# EAGLE board xenon-v1.00 (EAGLE 9.0.1), part 1 of 2
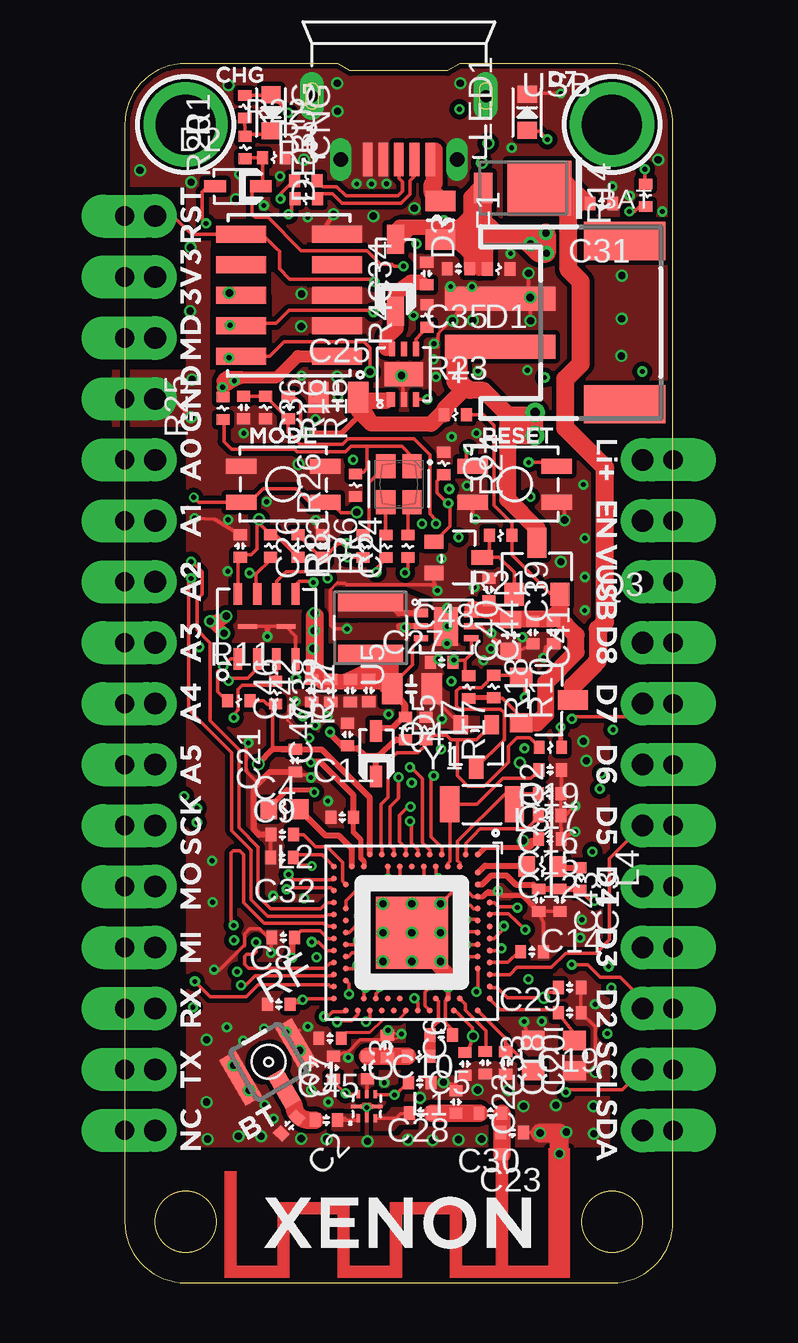
[diagram p1: board, top side]
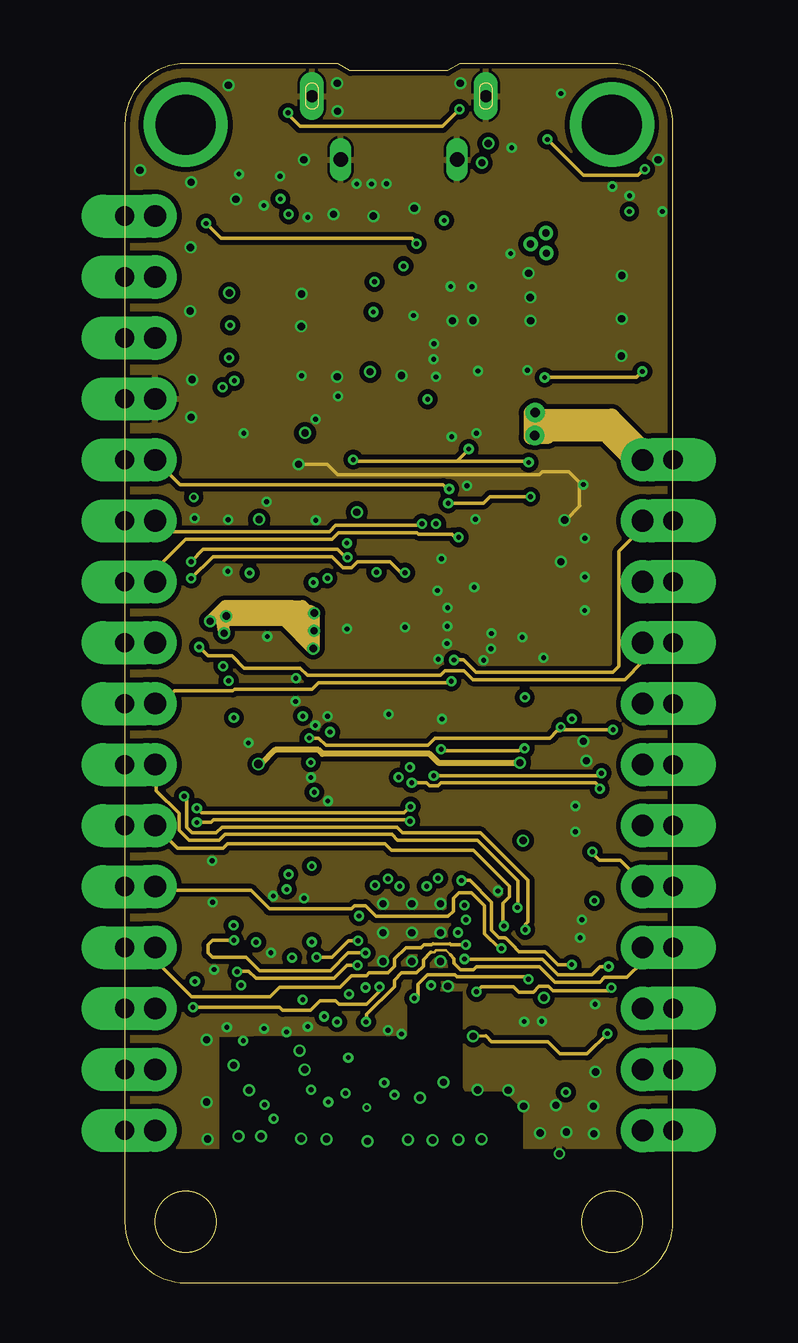
[diagram p2: board, inner layer Route2]
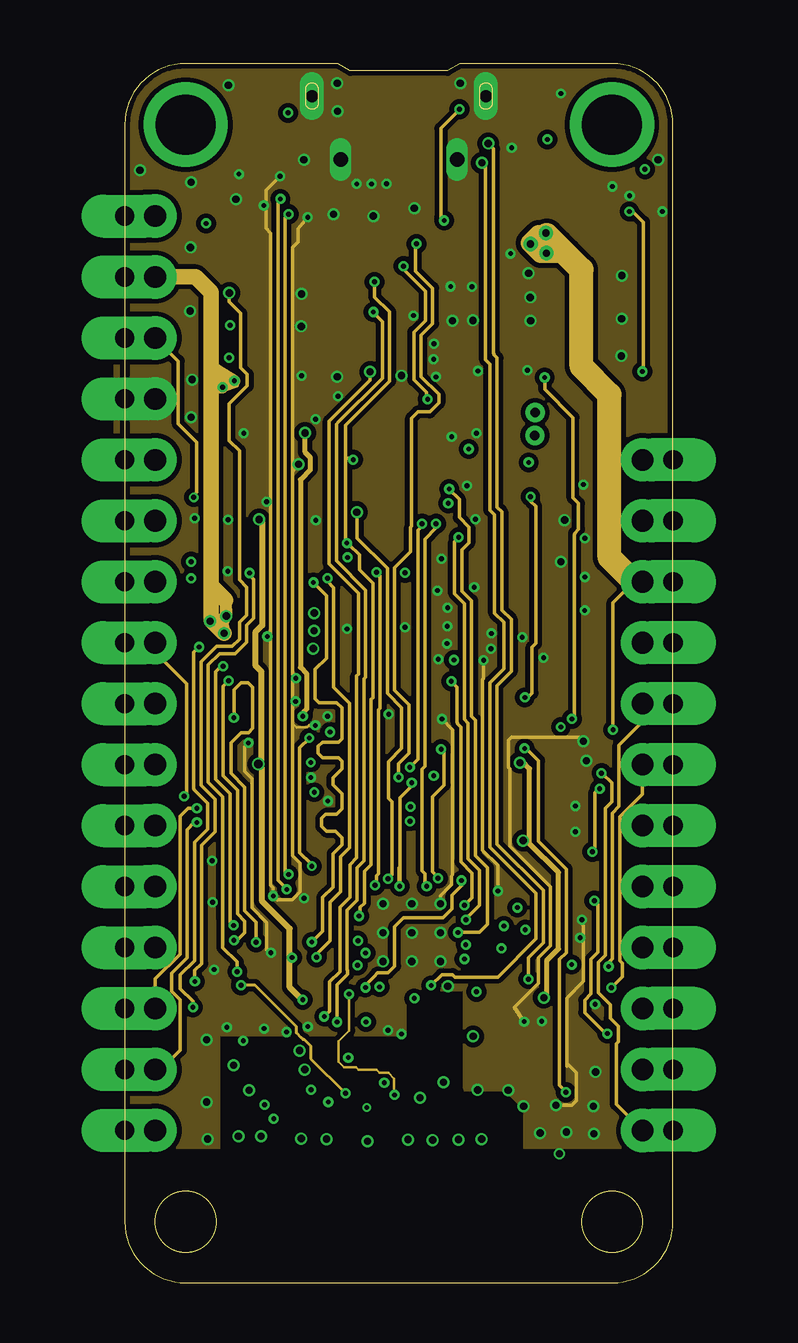
[diagram p3: board, inner layer Route15]
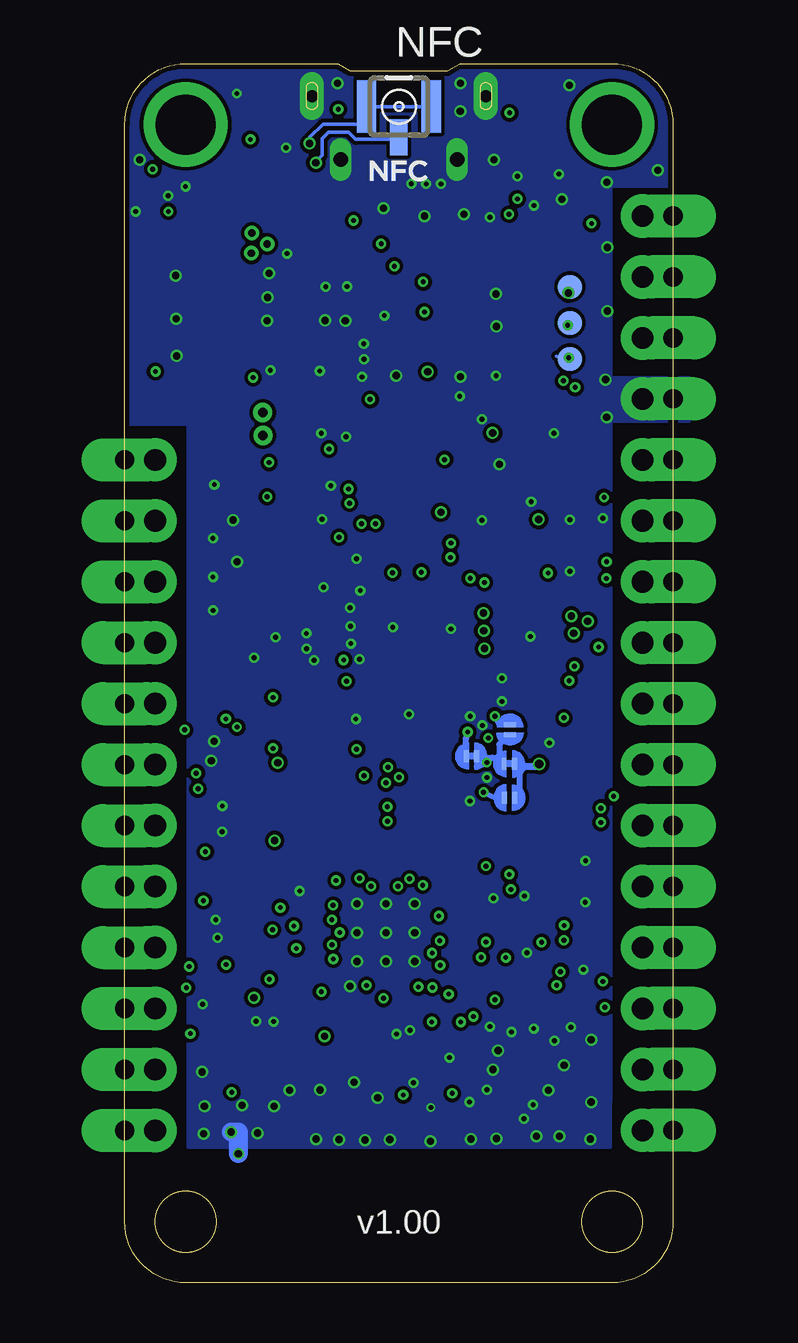
[diagram p4: board, bottom side, seen from below]

Size 22.86 x 50.8 mm. Coordinates in mm from the lower left corner, seen from the top.
Outline: 0,48.26 0,2.54 arc90 2.54,0 20.32,0 arc90 22.86,2.54 22.86,48.26 arc90 20.32,50.8 13.97,50.8 13.46,50.5 9.4,50.5 8.89,50.8 2.54,50.8 arc90 0,48.26
Outline: circle at 20.32,2.54 radius 1.27
Outline: circle at 2.54,2.54 radius 1.27
Copper layers (1+2*15+16): Top 0.035mm / dielectric 0.2mm / Route2 0.035mm / dielectric 0.7mm / Route15 0.035mm / dielectric 0.2mm / Bottom 0.035mm
Design rules "default *": minimum track width 4mil, minimum drill 0.2mm, track to track 6mil, track to pad 6mil, pad to pad 6mil, via to via 6mil, smd to smd 6mil, copper to edge 8mil, drill to drill 12mil, minimum pad ring 3mil, minimum via ring 3mil, stop-mask expansion 0.005mm, vias tented up to drill 16mil, thermal gap 4mil

## Footprints (pad centres in the part's own frame; a part is rotated, then mirrored left to right if it is on the bottom)
ANTENNA_F2_PCB = drill 0.305: GND 1.55,0.07 | smd 0.5 x 0.5: RF 3.95,0.09
CON_2.0MM_SMT = smd 1 x 4.6: 1 -1,-2.933; 2 1,-2.933 | smd 1.6 x 3.4: NC1 -3.4,2.267; NC2 3.4,2.267
TS-1185A-020 = smd 1.27 x 0.635: 1 -1.75,0.752; 2 1.75,0.752; 3 -1.75,-0.752; 4 1.75,-0.752
C-0402 = smd 0.45 x 0.55: 1 -0.47,0; 2 0.47,0
C0805 = smd 0.85 x 1.3: 1 -0.8,0; 2 0.85,0
C0603 = smd 0.7 x 0.85: 1 -0.65,0; 2 0.65,0
LED0603 = smd 0.7 x 0.8: 1 -0.75,0; 2 0.75,0
R-0402S = smd 0.45 x 0.55: 1 -0.47,0; 2 0.47,0
SOD-323 = smd 0.9 x 0.5: 1 -0.95,0; 2 0.95,0
SOD-123 = smd 1.2 x 0.7: 1 -1.5,0; 2 1.5,0
DIODE-DO-220AA(SMP) = smd 0.762 x 1.27: ANODE 2.349,0 | smd 2.667 x 2.3: CATHODE 0,0
CON5X2_1.27 = smd 0.7 x 2.1: 1 -2.54,-2; 2 -2.54,2; 3 -1.27,-2; 4 -1.27,2; 5 0,-2; 6 0,2; 7 1.27,-2; 8 1.27,2; 9 2.54,-2; 10 2.54,2
F0805 = smd 0.85 x 1.25: P$1 -0.8,0; P$2 0.8,0
HEADER_16P2.54 = drill 0.9 pad 1.8: 1 0,-19.05; 2 0,-16.51; 3 0,-13.97; 4 0,-11.43; 5 0,-8.89; 6 0,-6.35; 7 0,-3.81; 8 0,-1.27; 9 0,1.27; 10 0,3.81; 11 0,6.35; 12 0,8.89; 13 0,11.43; 14 0,13.97; 15 0,16.51; 16 0,19.05 | drill 0.8 pad 1.8 long: P$1 -1.27,-19.05; P$2 -1.27,-16.51; P$3 -1.27,-13.97; P$4 -1.27,-11.43; P$5 -1.27,-8.89; P$6 -1.27,-6.35; P$7 -1.27,-3.81; P$8 -1.27,-1.27; P$9 -1.27,1.27; P$10 -1.27,3.81; P$11 -1.27,6.35; P$12 -1.27,8.89; P$13 -1.27,11.43; P$14 -1.27,13.97; P$15 -1.27,16.51; P$16 -1.27,19.05
SIP-12 = drill 0.9 pad 1.8: 1 0,13.97; 2 0,11.43; 3 0,8.89; 4 0,6.35; 5 0,3.81; 6 0,1.27; 7 0,-1.27; 8 0,-3.81; 9 0,-6.35; 10 0,-8.89; 11 0,-11.43; 12 0,-13.97 | drill 0.8 pad 1.8 long: P$1 -1.27,13.97; P$2 -1.27,11.43; P$3 -1.27,8.89; P$4 -1.27,6.35; P$5 -1.27,3.81; P$6 -1.27,1.27; P$7 -1.27,-1.27; P$8 -1.27,-3.81; P$9 -1.27,-6.35; P$10 -1.27,-8.89; P$11 -1.27,-11.43; P$12 -1.27,-13.97
R-0603A = smd 0.7 x 0.85: 1 -0.65,0; 2 0.65,0
INDUCTOR-NR3015 = smd 0.8 x 2.7: 1 -1.1,0; 2 1.1,0
IPEX-20279-001E = smd 0.73 x 1.5: 1 0,1.28 | smd 0.8 x 2.2: 2@1 -1.35,0; 2@2 1.35,0
SOT323 = smd 0.6 x 0.8: 1 -0.65,-1; 2 0.65,-1 | smd 0.6 x 0.9: 3 0,1
SOT-23 = smd 0.8 x 0.95: 1 -0.95,-1; 2 0.95,-1 | smd 0.8 x 1.25: 3 0,1.15
SOT323' = smd 0.6 x 0.8: 1 -0.65,-0.95; 2 0.65,-0.95 | smd 0.6 x 0.9: 3 0,0.85
PLCC4-2MM-RGB = smd 1 x 0.8: BLUE -0.75,-0.55; CA 0.75,-0.55; GREEN -0.75,0.55; RED 0.75,0.55
TP_SHORT = smd 0.2 x 0.5: 1 -0.21,0; 2 0.21,0
TP_OPEN = smd 0.2 x 0.5: 1 -0.21,0; 2 0.21,0
TP = smd 1 x 1: P$1 0,0
TP-2.5 = drill 2.5 pad 3.2: 1 0,0
AQN507X7X0.85_HA-74_V2 = smd 3 x 3: P$74 0,0 | drill 0.3 pad 0.5: P$75 -1.2,1.2; P$76 0,1.2; P$77 1.2,1.2; P$78 -1.2,0; P$79 0,0; P$80 1.2,0; P$81 -1.2,-1.2; P$82 0,-1.2; P$85 1.2,-1.2 | smd 0.25 x 0.25: P$A8 -1.25,3.25; P$A10 -0.75,3.25; P$A12 -0.25,3.25; P$A14 0.25,3.25; P$A16 0.75,3.25; P$A18 1.25,3.25; P$A20 1.75,3.25; P$A22 2.25,3.25; P$A23 2.75,3.25; P$AA24 3.25,-2.25; P$AB2 -2.75,-2.5; P$AC5 -2,-2.75; P$AC9 -1,-2.75; P$AC11 -0.5,-2.75; P$AC13 0,-2.75; P$AC15 0.5,-2.75; P$AC17 1,-2.75; P$AC19 1.5,-2.75; P$AC21 2,-2.75; P$AC24 3.25,-2.75; P$AD2 -2.75,-3.25; P$AD4 -2.25,-3.25; P$AD6 -1.75,-3.25; P$AD8 -1.25,-3.25; P$AD10 -0.75,-3.25; P$AD12 -0.25,-3.25; P$AD14 0.25,-3.25; P$AD16 0.75,-3.25; P$AD18 1.25,-3.25; P$AD20 1.75,-3.25; P$AD22 2.25,-3.25; P$AD23 2.75,-3.25; P$B1 -3.25,2.75; P$B3 -2.5,2.75; P$B5 -2,2.75; P$B7 -1.5,2.75; P$B9 -1,2.75; P$B11 -0.5,2.75; P$B13 0,2.75; P$B15 0.5,2.75; P$B17 1,2.75; P$B19 1.5,2.75; P$B24 3.25,2.75; P$C1 -3.25,2.25; P$D2 -2.75,2; P$D23 2.75,2; P$E24 3.25,1.75; P$F2 -2.75,1.5; P$F23 2.75,1.5; P$G1 -3.25,1.25; P$H2 -2.75,1; P$H23 2.75,1; P$J1 -3.25,0.75; P$J24 3.25,0.75; P$K2 -2.75,0.5; P$L1 -3.25,0.25; P$L24 3.25,0.25; P$M2 -2.75,0; P$N1 -3.25,-0.25; P$N24 3.25,-0.25; P$P2 -2.75,-0.5; P$P23 2.75,-0.5; P$R1 -3.25,-0.75; P$R24 3.25,-0.75; P$T2 -2.75,-1; P$T23 2.75,-1; P$U1 -3.25,-1.25; P$U24 3.25,-1.25; P$V23 2.75,-1.5; P$W1 -3.25,-1.75; P$W24 3.25,-1.75; P$Y2 -2.75,-2; P$Y23 2.75,-2
USP-6C = smd 0.6 x 0.35: P$1 -1.05,0.55 | smd 0.6 x 0.25: P$2 -1.05,0; P$3 -1.05,-0.5; P$4 1.05,-0.5; P$5 1.05,0; P$6 1.05,0.5 | smd 1 x 1.6: P$7 0,0
USON8-3X4 = smd 0.9 x 0.35: 1 -1.35,1.2; 2 -1.35,0.4; 3 -1.35,-0.4; 4 -1.35,-1.2; 5 1.35,-1.2; 6 1.35,-0.4; 7 1.35,0.4; 8 1.35,1.2 | smd 0.2 x 0.8: 9 0,0.8; 10 0,-0.8
MLPD-6-1X1 = smd 0.33 x 0.15: P$1 -0.5,0.35; P$3 -0.5,-0.35; P$4 0.5,-0.35; P$5 0.5,0; P$6 0.5,0.35 | smd 0.45 x 0.15: P$2 -0.44,0 | smd 0.15 x 0.45: P$7 0,-0.43; P$8 0,0.43
MICRO_USB = smd 0.4 x 1.4: 1 1.3,0.1; 2 0.65,0.1; 3 0,0.1; 4 -0.65,0.1; 5 -1.3,0.1 | drill 0.6 pad 0.75 long: 6 2.425,0.1 | drill 0.5 pad 1 long: 7 3.625,2.75; 8 -3.625,2.75 | drill 0.6 pad 0.65 long: 9 -2.425,0.1
CRY_3215 = smd 0.8 x 1.5: 1 -1.35,0; 2 1.35,0
CRY_2520 = smd 0.95 x 0.8: 1 -0.86,-0.63; 2 0.86,-0.63; 3 0.86,0.63; 4 -0.86,0.64

## Placement (x,y rotation side)
ANT  ANT_F  [ANTENNA_F2_PCB]  19.67,5.45 180 top
BAT  CON2P_SMT  [CON_2.0MM_SMT]  18.58,40 270 top
BUTTON  TS-1185A-020  [TS-1185A-020]  6.6,33.27 180 top
C1  10pF  [C-0402]  8.41,6.78 0 top
C2  NC  [C-0402]  6.86,6.55 225 top
C3  33PF  [C-0402]  8.71,8.96 270 top
C4  4.7uF  [C-0402]  6.57,18.68 0 top
C5  1pF  [C-0402]  13.2,10.33 180 top
C6  1pF  [C-0402]  10.95,9.85 270 top
C7  10pF  [C-0402]  10.12,8.97 90 top
C8  O.1uF  [C-0402]  6.42,11.6 0 top
C9  4.7uF  [C-0402]  6.56,17.72 0 top
C10  10pF  [C-0402]  12.34,7.07 0 top
C11  4.7uF  [C-0402]  9.07,19.4 0 top
C12  1uF  [C-0402]  17.73,18.49 180 top
C13  1uF  [C-0402]  18.14,15.94 270 top
C14  1uF  [C-0402]  18.56,12.31 0 top
C15  O.1uF  [C-0402]  17.72,19.47 180 top
C16  12pF  [C-0402]  17.72,20.38 180 top
C17  12pF  [C-0402]  17.74,21.37 180 top
C18  100pF  [C-0402]  15.03,9.17 270 top
C19  12pF  [C-0402]  18.56,11.25 180 top
C20  12pF  [C-0402]  15.88,9.15 270 top
C21  4.7uF  [C-0402]  7.12,21.76 90 top
C22  0.5pF  [C-0402]  13.81,7.53 270 top
C23  0.5pF  [C-0402]  16.16,6.26 180 top
C24  0.1uF  [C-0402]  8.26,30.7 270 top
C25  10uF  [C0805]  8.88,36.9 0 top
C26  O.1uF  [C-0402]  4.82,30.7 270 top
C27  22uF  [C0805]  11.95,24.75 0 top
C28  33pF  [C-0402]  12.3,8.34 180 top
C29  NC  [C-0402]  16.98,13.79 180 top
C30  1.2nH  [C-0402]  15.25,7.07 180 top
C31  O.1uF  [C-0402]  19.87,44.97 180 top
C32  O.1uF  [C-0402]  6.61,14.39 0 top
C33  nc  [C-0402]  14.19,9.12 270 top
C34  0.1uF  [C-0402]  12.59,42.05 90 top
C35  0.1uF  [C-0402]  13.92,42.25 180 top
C36  10nF  [C-0402]  4.96,36.47 270 top
C37  0.1UF  [C-0402]  10.18,24.68 90 top
C38  1000pF  [C-0402]  9.4,24.67 90 top
C39  0.1UF  [C-0402]  15.18,28.89 270 top
C40  1000pF  [C-0402]  17.02,27.1 90 top
C41  10uF  [C0603]  16.09,26.98 270 top
C42  100pF  [C-0402]  8.59,24.67 90 top
C43  47nF  [C-0402]  17.26,15.94 270 top
C44  100pF  [C-0402]  17.88,27.09 90 top
C45  820pF  [C-0402]  8.56,10.19 180 top
C46  33pF  [C-0402]  7.8,24.67 90 top
C47  4.7UF  [C-0402]  9.29,22.84 90 top
C48  10nF  [C-0402]  13.22,25.85 0 top
CNG  ORANGE  [LED0603]  6.1,48.75 270 top
D1  nc  [R-0402S]  15.59,42.24 180 top
D2  LRB551V  [SOD-323]  4.72,45.69 0 top
D3  B5819w  [SOD-123]  11.29,41.98 270 top
D4  ss3p  [DIODE-DO-220AA(SMP)]  17.29,45.61 180 top
D5  NC  [SOD-323]  10.48,22.04 270 top
DEBUG  CON5X2  [CON5X2_1.27]  6.85,41.15 90 top
F1  6V 1A  [F0805]  13.17,44.27 270 top
HEAD1  HEADER_16P  [HEADER_16P2.54]  1.27,25.4 0 top
HEAD2  SIP-12  [SIP-12]  21.59,20.32 180 top
L1  3.9nH  [R-0402S]  12.26,9.43 180 top
L2  10uH  [R-0603A]  6.66,19.73 180 top
L3  10uH  [R-0603A]  17.41,17.35 0 top
L4  15nH  [R-0402S]  18.98,16.83 270 top
L5  NR3015T4R7M  [INDUCTOR-NR3015]  10.25,27.29 270 top
L7  15nH  [R-0402S]  11.7,23.1 270 top
LED1  blue  [LED0603]  16.78,48.77 90 top
NFC  UFL  [IPEX-20279-001E]  11.43,49.01 180 bottom
Q1  2n7002  [SOT323]  13.9,30.23 270 top
Q2  IRLML6401  [SOT-23]  17.53,24.28 270 top
Q3  IRLML6401  [SOT-23]  17.19,29.69 0 top
Q4  2n7002  [SOT323']  14.65,22.3 180 top
R1  3K  [R-0402S]  5.01,49 90 top
R2  0R  [R-0402S]  7.55,45.92 0 top
R3  0R  [R-0402S]  7.57,45.16 0 top
R4  2K  [R-0402S]  12.6,40.28 90 top
R5  1K  [R-0402S]  11.81,30.69 90 top
R6  10K  [R-0402S]  7.23,30.7 270 top
R7  1K  [R-0402S]  10.9,30.69 90 top
R8  1K  [R-0402S]  9.94,30.69 90 top
R10  30K  [R-0402S]  15.38,24.84 270 top
R11  100k  [R-0402S]  4.75,24.25 0 top
R12  NC  [R-0402S]  6.29,24.59 270 top
R13  NC  [R-0402S]  6.08,30.7 270 top
R14  1K  [R-0402S]  21.72,45.31 90 top
R15  806K 1%  [R-0402S]  6.82,36.47 270 top
R16  2M1%  [R-0402S]  5.87,36.47 270 top
R17  10K  [R-0402S]  12.56,23.09 270 top
R18  200K  [R-0402S]  14.34,24.82 270 top
R19  5.6k  [R-0402S]  17.75,22.31 180 top
R20  1K  [R-0402S]  5.02,47.3 90 top
R21  806k  [R-0402S]  15.67,31.14 180 top
R22  6.2K  [R-0402S]  6.22,46.88 0 top
R23  200k  [R-0402S]  13.78,36.17 0 top
R24  NC  [R-0402S]  13.3,34.14 270 top
R25  0R  [R-0402S]  4.1,36.44 90 top
R26  nc  [R-0402S]  9.62,33.23 90 top
RESET  TS-1185A-020  [TS-1185A-020]  16.26,33.27 180 top
RF  UFL  [IPEX-20279-001E]  6,9.2 210 top
RGB  RGB-LED-CLMVB-FKARGB  [PLCC4-2MM-RGB]  11.43,33.27 90 top
S1  TP_SHORT  [TP_SHORT]  6.83,21.62 180 bottom
S3  TP_OPEN  [TP_OPEN]  6.82,20.21 0 bottom
S4  TP_OPEN  [TP_OPEN]  6.8,23.04 270 bottom
S5  TP_SHORT  [TP_SHORT]  8.41,21.94 180 bottom
SWDC  TPTP  [TP]  4.3,40 0 bottom
SWDI  TPTP  [TP]  4.3,38.5 0 bottom
SWO  TPTP  [TP]  4.3,41.5 0 bottom
TP1  TPTP2.5  [TP-2.5]  20.32,48.26 270 top
TP2  TPTP2.5  [TP-2.5]  2.54,48.26 270 top
U1  NRF52840V02  [AQN507X7X0.85_HA-74_V2]  11.97,14.59 270 top
U3  XC6208A42  [USP-6C]  11.64,37.86 90 top
U5  FLASH-SPIUSON-8L-4X3  [USON8-3X4]  5.92,27.35 90 top
U6  XC9258A33CER  [USP-6C]  13.4,27.35 0 top
U$2  SKY13351-378LF  [MLPD-6-1X1]  10.09,7.35 90 top
USB  MICRO_USB_5P  [MICRO_USB]  11.43,46.7 0 top
Y1  32.768K 9P 20PPM  [CRY_3215]  14.9,19.93 0 top
Y2  32M 8P 10PPM  [CRY_2520]  17.89,9.47 0 top